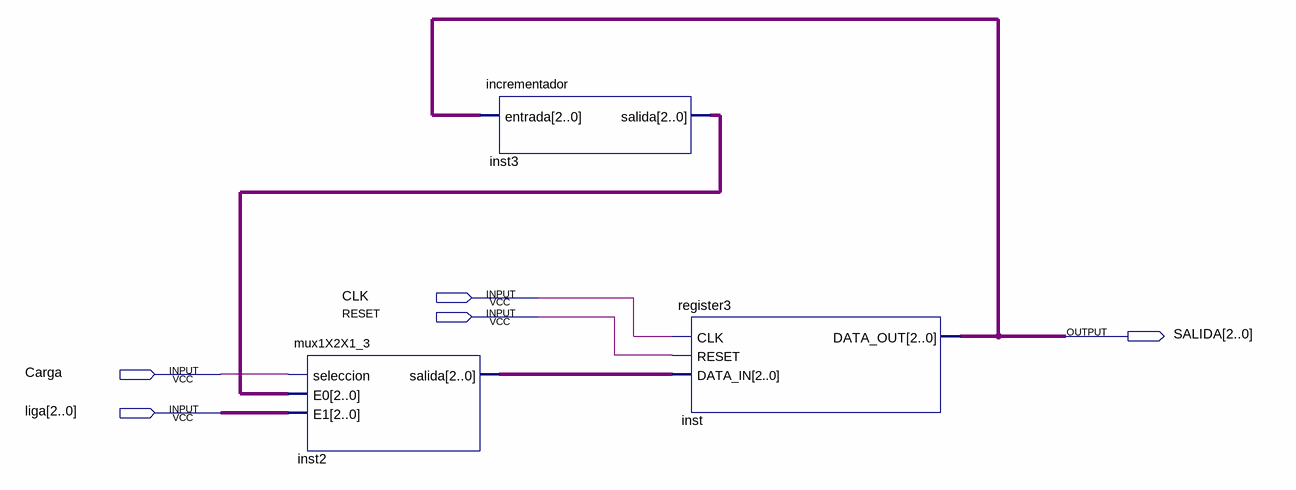
[diagram p0: schematic sheet]
// Quartus schematic contador.bdf as structural Verilog: 3 symbols, 5 pins
module contador (
  input  CLK,
  input  RESET,
  input  Carga,
  input  [2:0] liga,
  output [2:0] SALIDA
);

  wire [2:0] inst2_salida, inst3_salida;

  mux1X2X1_3 inst2 (.seleccion(Carga), .E0(inst3_salida), .E1(liga), .salida(inst2_salida));
  incrementador inst3 (.entrada(SALIDA), .salida(inst3_salida));
  register3 inst (.CLK(CLK), .RESET(RESET), .DATA_IN(inst2_salida), .DATA_OUT(SALIDA));
endmodule
